# Altium schematic sheet AC220V-DC5V SCH.SchDoc: AC220V-DC5V
size A; Author: 宋海龙; SheetNumber: 1; SheetTotal: 2
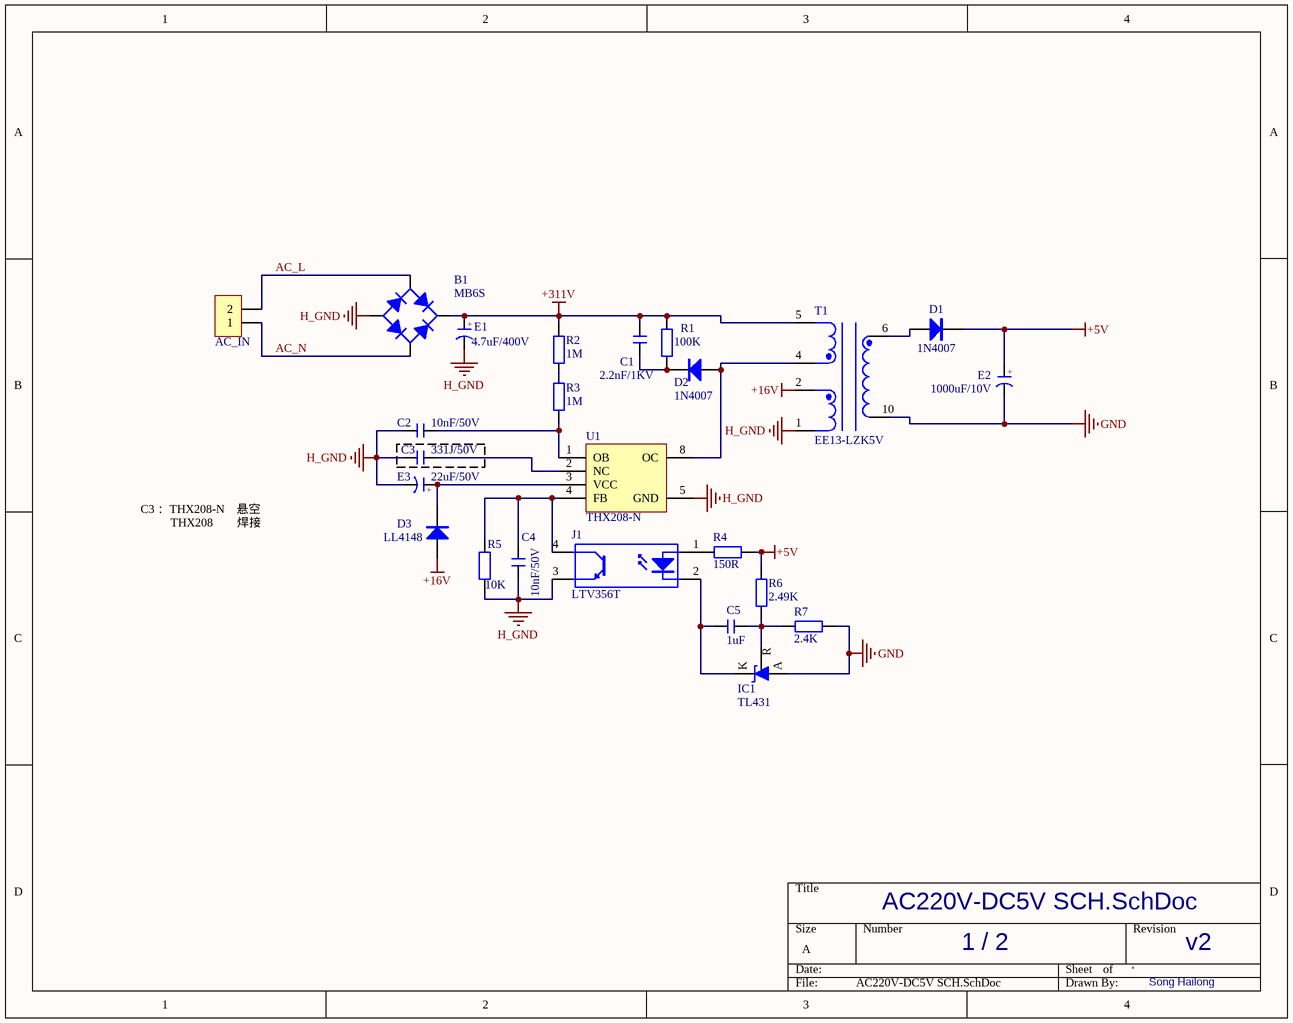
[diagram p0: AC220V-DC5V SCH.SchDoc]

## Parts
AC_IN  HDR-1X2  [KF301-5.0-2P]  (value not drawn)
B1  MB6S  [MBS]
C1  2.2nF/1KV  [CBB 5*6.3*3]
C2  10nF/50V  [C 0603_L]
C3  331J/50V  [C 0603_L]
C4  10nF/50V  [C 0603_L]
C5  1uF  [C 0603_L]
D1  1N4007  [SMA]
D2  1N4007  [SMA]
D3  LL4148  [MINI_MELF (LL34)]
E1  4.7uF/400V  [CAP 2.5*6.3*11.2 - GD]
E2  1000uF/10V  [CAP 3.5*8*11.5]
E3  22uF/50V  [CAP 2.0*5*11]
IC1  TL431  [SOT23-3M]
J1  LTV356T  [SOP4_N]
R1  100K  [R 0603_L]
R2  1M  [R 0603_L]
R3  1M  [R 0603_L]
R4  150R  [R 0603_L]
R5  10K  [R 0603_L]
R6  2.49K  [R 0603_L]
R7  2.4K  [R 0603_L]
T1  EE13-LZK5V  [EE13-5V 4+2]
U1  THX208-N  [SOP8-6D]

## Nets
+5V: D1.2(K) E2.1(A) R4.1 R6.1
+16V: D3.1(A) T1.2
+311V: B1.DC+ C1.2 E1.1(A) R1.1 R2.1 T1.5
GND: E2.2(K) IC1.3(A) R7.2 T1.10
H_GND: B1.DC- C2.2 C3.2 C4.2 E1.2(K) E3.2(K) J1.3(E) R5.1 T1.1 U1.5(GND)
AC_L: AC_IN.2 B1.AC1
AC_N: AC_IN.1 B1.AC2
NetC1_1: C1.1 D2.2(K) R1.2
NetC2_1: C2.1 R3.2 U1.1(OB)
NetC3_1: C3.1 U1.2(NC)
NetC4_1: C4.1 J1.4(C) R5.2 U1.4(FB)
NetC5_1: C5.1 IC1.2(K) J1.2(K)
NetC5_2: C5.2 IC1.1(R) R6.2 R7.1
NetD1_1: D1.1(A) T1.6
NetD2_1: D2.1(A) T1.4 U1.8(OC)
NetD3_2: D3.2(K) E3.1(A) U1.3(VCC)
NetJ1_1: J1.1(A) R4.2
NetR2_2: R2.2 R3.1

## Notes on the sheet
- C3： THX208-N    悬空
  THX208        焊接
- /
- v2
- Song Hailong
- (in symbol C-CAP) +

## Library data of the parts
AC_IN = Header 02 5.0: 2P接插件; 版权归属: 源创客; BOM名称: 2P接插件; 学习资源: www.ooocke.com
B1 = DB: 整流桥; 版权归属: 源创客; BOM名称: 整流桥; 学习资源: www.ooocke.com
C1 = C-CBB: CBB电容; 版权归属: 源创客; BOM名称: CBB电容; 学习资源: www.ooocke.com
C2-C5 = C: 无极性贴片电容; 版权归属: 源创客; BOM名称: 无极性贴片电容; 学习资源: www.ooocke.com
D1 D2 = 1N4007: 整流二极管; 版权归属: 源创客; BOM名称: 整流二极管; 学习资源: www.ooocke.com
D3 = 1N4148: 高速开关二极管; 版权归属: 源创客; BOM名称: 高速开关二极管; 学习资源: www.ooocke.com
E1-E3 = C-CAP: 直插电解电容; 版权归属: 源创客; BOM名称: 直插电解电容; 学习资源: www.ooocke.com
IC1 = TL431_SMD: 可调基准稳压芯片; 版权归属: 源创客; BOM名称: 可调基准稳压芯片; 学习资源: www.ooocke.com
J1 = TLP181: 光耦; 版权归属: 源创客; BOM名称: 光耦; 学习资源: www.ooocke.com
R1-R7 = R: 贴片电阻; 版权归属: 源创客; BOM名称: 贴片电阻; 学习资源: www.ooocke.com
T1 = EE13-LZK5V: EE13-LZK5V型 2.50mH立式 高频变压器; 购买链接: https://item.taobao.com/item.htm?spm=a1z0d.6639537.1997196601.13.1d207484ADZQT6&id=567021687365
U1 = THX208-N: 开关电源芯片